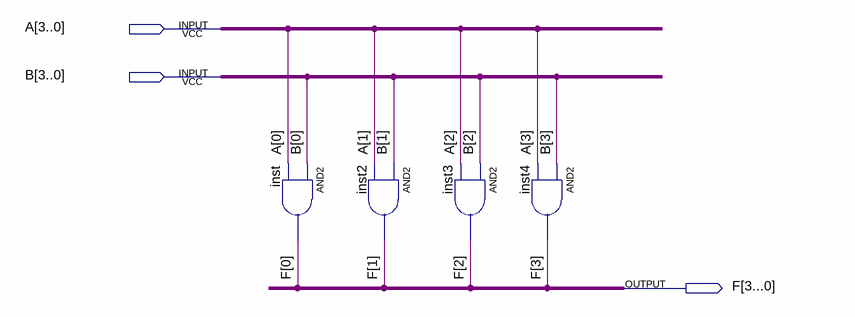
[diagram p0: schematic sheet]
// Quartus schematic And.bdf as structural Verilog: 4 symbols, 3 pins
module And (
  input  [3:0] A,
  input  [3:0] B,
  output \F[3...0] 
);

  wire [3:0] F;

  and inst (F[0], B[0], A[0]);
  and inst2 (F[1], B[1], A[1]);
  and inst3 (F[2], B[2], A[2]);
  and inst4 (F[3], B[3], A[3]);
endmodule
